# EAGLE design bus (EAGLE 9.6.0)
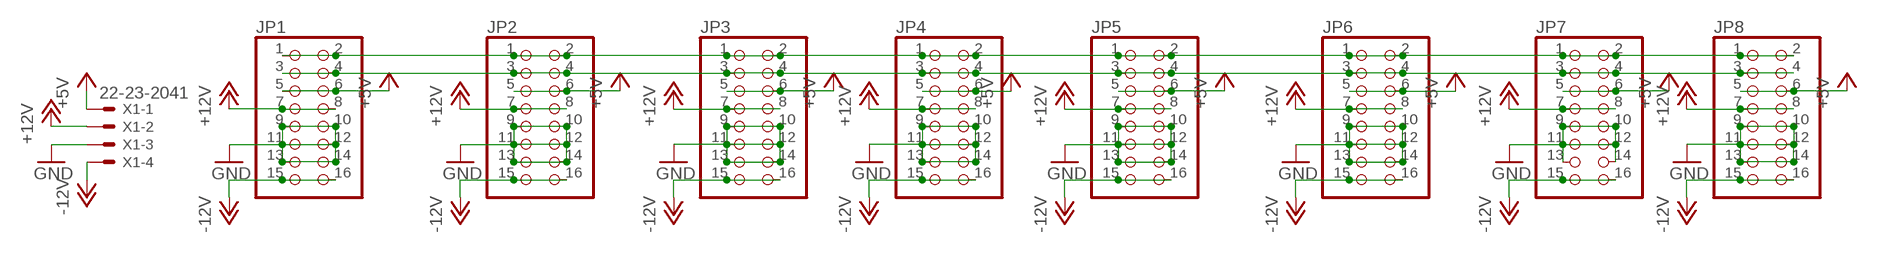
[diagram p0: schematic, sheet 1]

## Parts
JP1  PINHD-2X8  [2X08]
JP2  PINHD-2X8  [2X08]
JP3  PINHD-2X8  [2X08]
JP4  PINHD-2X8  [2X08]
JP5  PINHD-2X8  [2X08]
JP6  PINHD-2X8  [2X08]
JP7  PINHD-2X8  [2X08]
JP8  PINHD-2X8  [2X08]
X1  22-23-2041  [22-23-2041]

## Nets
+5V: JP1.5 JP1.6 JP2.5 JP2.6 JP3.5 JP3.6 JP4.5 JP4.6 JP5.5 JP5.6 JP6.5 JP6.6 JP7.5 JP7.6 JP8.5 JP8.6 X1.1
+12V: JP1.7 JP1.8 JP2.7 JP2.8 JP3.7 JP3.8 JP4.7 JP4.8 JP5.7 JP5.8 JP6.7 JP6.8 JP7.7 JP7.8 JP8.7 JP8.8 X1.2
-12V: JP1.15 JP1.16 JP2.15 JP2.16 JP3.15 JP3.16 JP4.15 JP4.16 JP5.15 JP5.16 JP6.15 JP6.16 JP7.15 JP7.16 JP8.15 JP8.16 X1.4
GND: JP1.9 JP1.10 JP1.11 JP1.12 JP1.13 JP1.14 JP2.9 JP2.10 JP2.11 JP2.12 JP2.13 JP2.14 JP3.9 JP3.10 JP3.11 JP3.12 JP3.13 JP3.14 JP4.9 JP4.10 JP4.11 JP4.12 JP4.13 JP4.14 JP5.9 JP5.10 JP5.11 JP5.12 JP5.13 JP5.14 JP6.9 JP6.10 JP6.11 JP6.12 JP6.13 JP6.14 JP7.9 JP7.10 JP7.11 JP7.12 JP7.13 JP7.14 JP8.9 JP8.10 JP8.11 JP8.12 JP8.13 JP8.14 X1.3
N$19: JP1.3 JP1.4 JP2.3 JP2.4 JP3.3 JP3.4 JP4.3 JP4.4 JP5.3 JP5.4 JP6.3 JP6.4 JP7.3 JP7.4 JP8.3 JP8.4
N$45: JP1.1 JP1.2 JP2.1 JP2.2 JP3.1 JP3.2 JP4.1 JP4.2 JP5.1 JP5.2 JP6.1 JP6.2 JP7.1 JP7.2 JP8.1 JP8.2

## Library data of the parts
JP1-JP8 = pinhead:PINHD-2X8: PIN HEADER
X1 = con-molex:22-23-2041: .100" (2.54mm) Center Header - 4 Pin; MF: MOLEX; MPN: 22-23-2041; OC_FARNELL: 1462920; OC_NEWARK: 38C0355

## Board
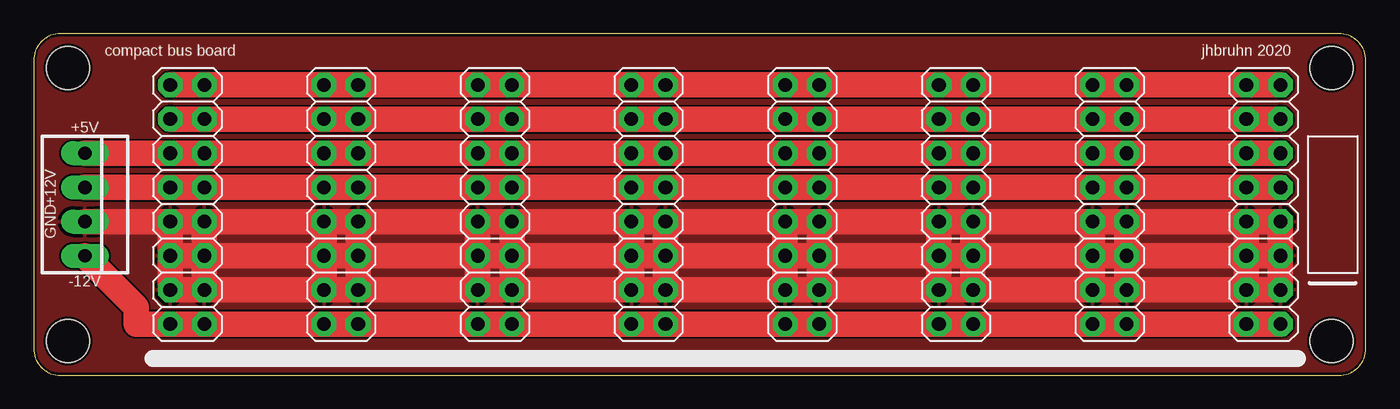
[diagram p1: board, top side]
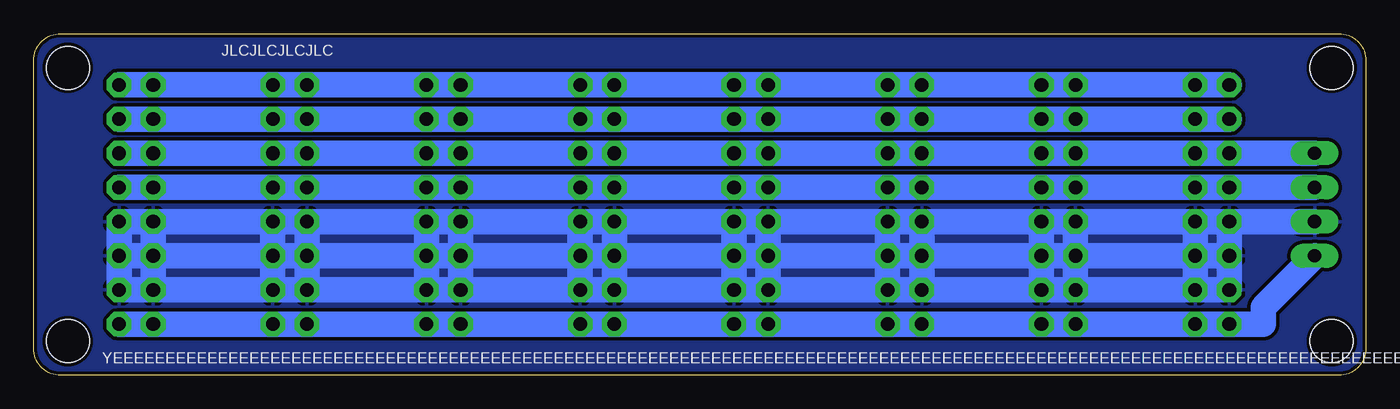
[diagram p2: board, bottom side, seen from below]

Size 99.06 x 25.4 mm. Coordinates in mm from the lower left corner, seen from the top.
Outline: 2,0 97.06,0 arc90 99.06,2 99.06,23.4 arc90 97.06,25.4 2,25.4 arc90 0,23.4 0,2 arc90 2,0
Copper layers (1*16): Top 0.035mm / dielectric 1.6mm / Bottom 0.035mm
Design rules "jlcpcb-2layers": minimum track width 5mil, minimum drill 0.3mm, track to track 5mil, track to pad 5mil, pad to pad 5mil, via to via 5mil, smd to smd 5mil, copper to edge 0.2mm, drill to drill 6mil, minimum pad ring 10mil, minimum via ring 3mil, stop-mask expansion 4mil, vias tented up to drill 0mil, thermal gap 10mil
Holes 3.2 mm at 2.54,2.54 96.52,2.54 96.52,22.86 2.54,22.86

### Footprints (pad centres in the part's own frame; a part is rotated, then mirrored left to right if it is on the bottom)
2X08 = drill 1.016 octagon: 1 -8.89,-1.27; 2 -8.89,1.27; 3 -6.35,-1.27; 4 -6.35,1.27; 5 -3.81,-1.27; 6 -3.81,1.27; 7 -1.27,-1.27; 8 -1.27,1.27; 9 1.27,-1.27; 10 1.27,1.27; 11 3.81,-1.27; 12 3.81,1.27; 13 6.35,-1.27; 14 6.35,1.27; 15 8.89,-1.27; 16 8.89,1.27
22-23-2041 = drill 1 long: 1 -3.81,0; 2 -1.27,0; 3 1.27,0; 4 3.81,0

### Placement (x,y rotation side)
JP1  11.43,12.7 270 top
JP2  22.86,12.7 270 top
JP3  34.29,12.7 270 top
JP4  45.72,12.7 270 top
JP5  57.15,12.7 270 top
JP6  68.58,12.7 270 top
JP7  80.01,12.7 270 top
JP8  91.44,12.7 270 top
X1  3.81,12.7 270 top

### Tracks (layer width: path | path; a pad name or v marks a point on that pad's centre or on a via)
+5V
  Top 1.905: X1.1 JP8.6
  Bottom 1.905: X1.1 JP1.5 JP1.6 JP2.5 JP2.6 JP3.5 JP3.6 JP4.5 JP4.6 JP5.5 JP5.6 JP6.5 JP6.6 JP7.5 JP7.6 JP8.5 JP8.6
+12V
  Top 1.905: X1.2 JP8.8
  Bottom 1.905: JP8.8 JP8.7 JP7.8 JP7.7 JP6.8 JP6.7 JP5.8 JP5.7 JP4.8 JP4.7 JP3.8 JP3.7 JP2.8 JP2.7 JP1.8 JP1.7 X1.2
-12V
  Top 1.905: JP8.16 JP8.15 JP7.16 JP7.15 JP6.16 JP6.15 JP5.16 JP5.15 JP4.16 JP4.15 JP3.16 JP3.15 JP2.16 JP2.15 JP1.16 JP1.15 7.62,3.81 7.62,5.08 X1.4
  Bottom 1.905: JP8.16 JP1.15 7.62,3.81 7.62,5.08 X1.4
GND
  Top 1.905: JP2.9 JP2.11 | JP2.11 JP2.13 | JP2.13 JP2.14 | JP2.14 JP2.12 | JP2.12 JP2.10 | JP2.10 JP3.9 | JP2.11 JP2.12 | JP2.12 JP3.11 | JP2.14 JP3.13 | JP3.9 JP3.10 | JP3.11 JP3.12 | JP3.13 JP3.14 | JP3.14 JP4.13 | JP4.13 JP4.14 | JP3.12 JP4.11 | JP3.10 JP4.9 | JP4.9 JP4.10 | JP4.9 JP4.11 | JP4.11 JP4.12 | JP4.12 JP4.14 | JP4.12 JP4.10 | JP4.11 JP4.13 | JP3.11 JP3.13 | JP3.12 JP3.14 | JP3.10 JP3.12 | JP3.9 JP3.11 | JP4.10 JP5.9 | JP5.9 JP5.10 | JP5.9 JP5.11 | JP4.12 JP5.11 | JP4.14 JP5.13 | JP5.13 JP5.11 | JP5.11 JP5.12 | JP5.12 JP5.14 | JP5.14 JP5.13 | JP5.10 JP5.12 | JP5.12 JP6.11 | JP5.10 JP6.9 | JP6.9 JP6.11 | JP6.11 JP6.13 | JP6.13 JP6.14 | JP5.14 JP6.13 | JP6.12 JP6.14 | JP6.12 JP6.11 | JP6.9 JP6.10 | JP6.10 JP6.12 | JP6.10 JP7.9 | JP7.9 JP7.11 | JP7.11 JP6.12 | JP6.14 JP7.13 | JP7.9 JP7.10 | JP7.10 JP7.12 | JP7.12 JP7.11 | JP7.11 JP7.13 | JP7.13 JP7.14 | JP7.14 JP7.12 | JP7.12 JP8.11 | JP8.9 JP7.10 | JP8.9 JP8.11 | JP8.11 JP8.13 | JP7.14 JP8.13 | JP8.13 JP8.14 JP8.12 | JP8.11 JP8.12 | JP8.12 JP8.10 JP8.9 | X1.3 JP2.10 | JP2.11 JP1.11 | JP2.13 JP1.14 | JP1.14 JP1.13 JP1.9 | JP1.10 JP1.14
  Bottom 1.905: X1.3 JP1.9 | JP1.9 JP1.11 | JP1.11 JP1.13 JP1.14 | JP1.14 JP1.12 | JP1.12 JP1.11 | JP1.9 JP1.10 | JP1.10 JP2.9 | JP1.10 JP1.12 | JP1.12 JP2.11 JP3.11 | JP2.13 JP1.14 | JP2.9 JP2.13 | JP2.10 JP2.14 | JP2.10 JP2.9 | JP2.13 JP3.13 | JP2.10 JP3.10 | JP3.9 JP3.11 | JP3.11 JP3.13 | JP3.10 JP3.14 | JP3.10 JP4.10 | JP4.10 JP5.10 | JP5.10 JP8.10 JP8.14 JP8.13 | JP8.12 JP3.11 | JP3.13 JP4.13 | JP4.13 JP5.13 | JP5.13 JP6.13 | JP6.13 JP6.14 | JP6.14 JP7.13 | JP7.13 JP7.14 | JP7.14 JP8.13 | JP4.9 JP4.13 | JP4.14 JP4.10 | JP5.9 JP5.13 | JP5.14 JP5.10 | JP6.9 JP6.13 | JP6.10 JP6.14 | JP7.9 JP7.13 | JP7.10 JP7.14 | JP8.9 JP8.13
  pour Bottom (isolate 0.254): 0,25.4 0,0 99.06,0 99.06,25.4
  pour Top (isolate 0.127): 0,25.4 0,0 99.06,0 99.06,25.4
N$19
  Top 1.905: JP1.3 JP8.4
  Bottom 1.905: JP8.4 JP8.3 JP7.4 JP7.3 JP6.4 JP6.3 JP5.4 JP5.3 JP4.4 JP4.3 JP3.4 JP3.3 JP2.4 JP2.3 JP1.4 JP1.3
N$45
  Top 1.905: JP8.2 JP1.1
  Bottom 1.905: JP1.1 JP1.2 JP2.1 JP2.2 JP3.1 JP3.2 JP4.1 JP4.2 JP5.1 JP5.2 JP6.1 JP6.2 JP7.1 JP7.2 JP8.1 JP8.2

### Text on the board
tNames: compact bus board | jhbruhn 2020 | +5V | +12V | GND | -12V
bNames: JLCJLCJLCJLC | YEEEEEEEEEEEEEEEEEEEEEEEEEEEEEEEEEEEEEEEEEEEEEEEEEEEEEEEEEEEEEEEEEEEEEEEEEEEEEEEEEEEEEEEEEEEEEEEEEEEEEEEEEEEEEEEEEEEEEEEEEEEEEEEEEEEEET
tStop: Gate / CV / +5V / +12V / GND / GND / GND / -12V